# EAGLE design GPIOpiLeafSkell (EAGLE 7.6.0)
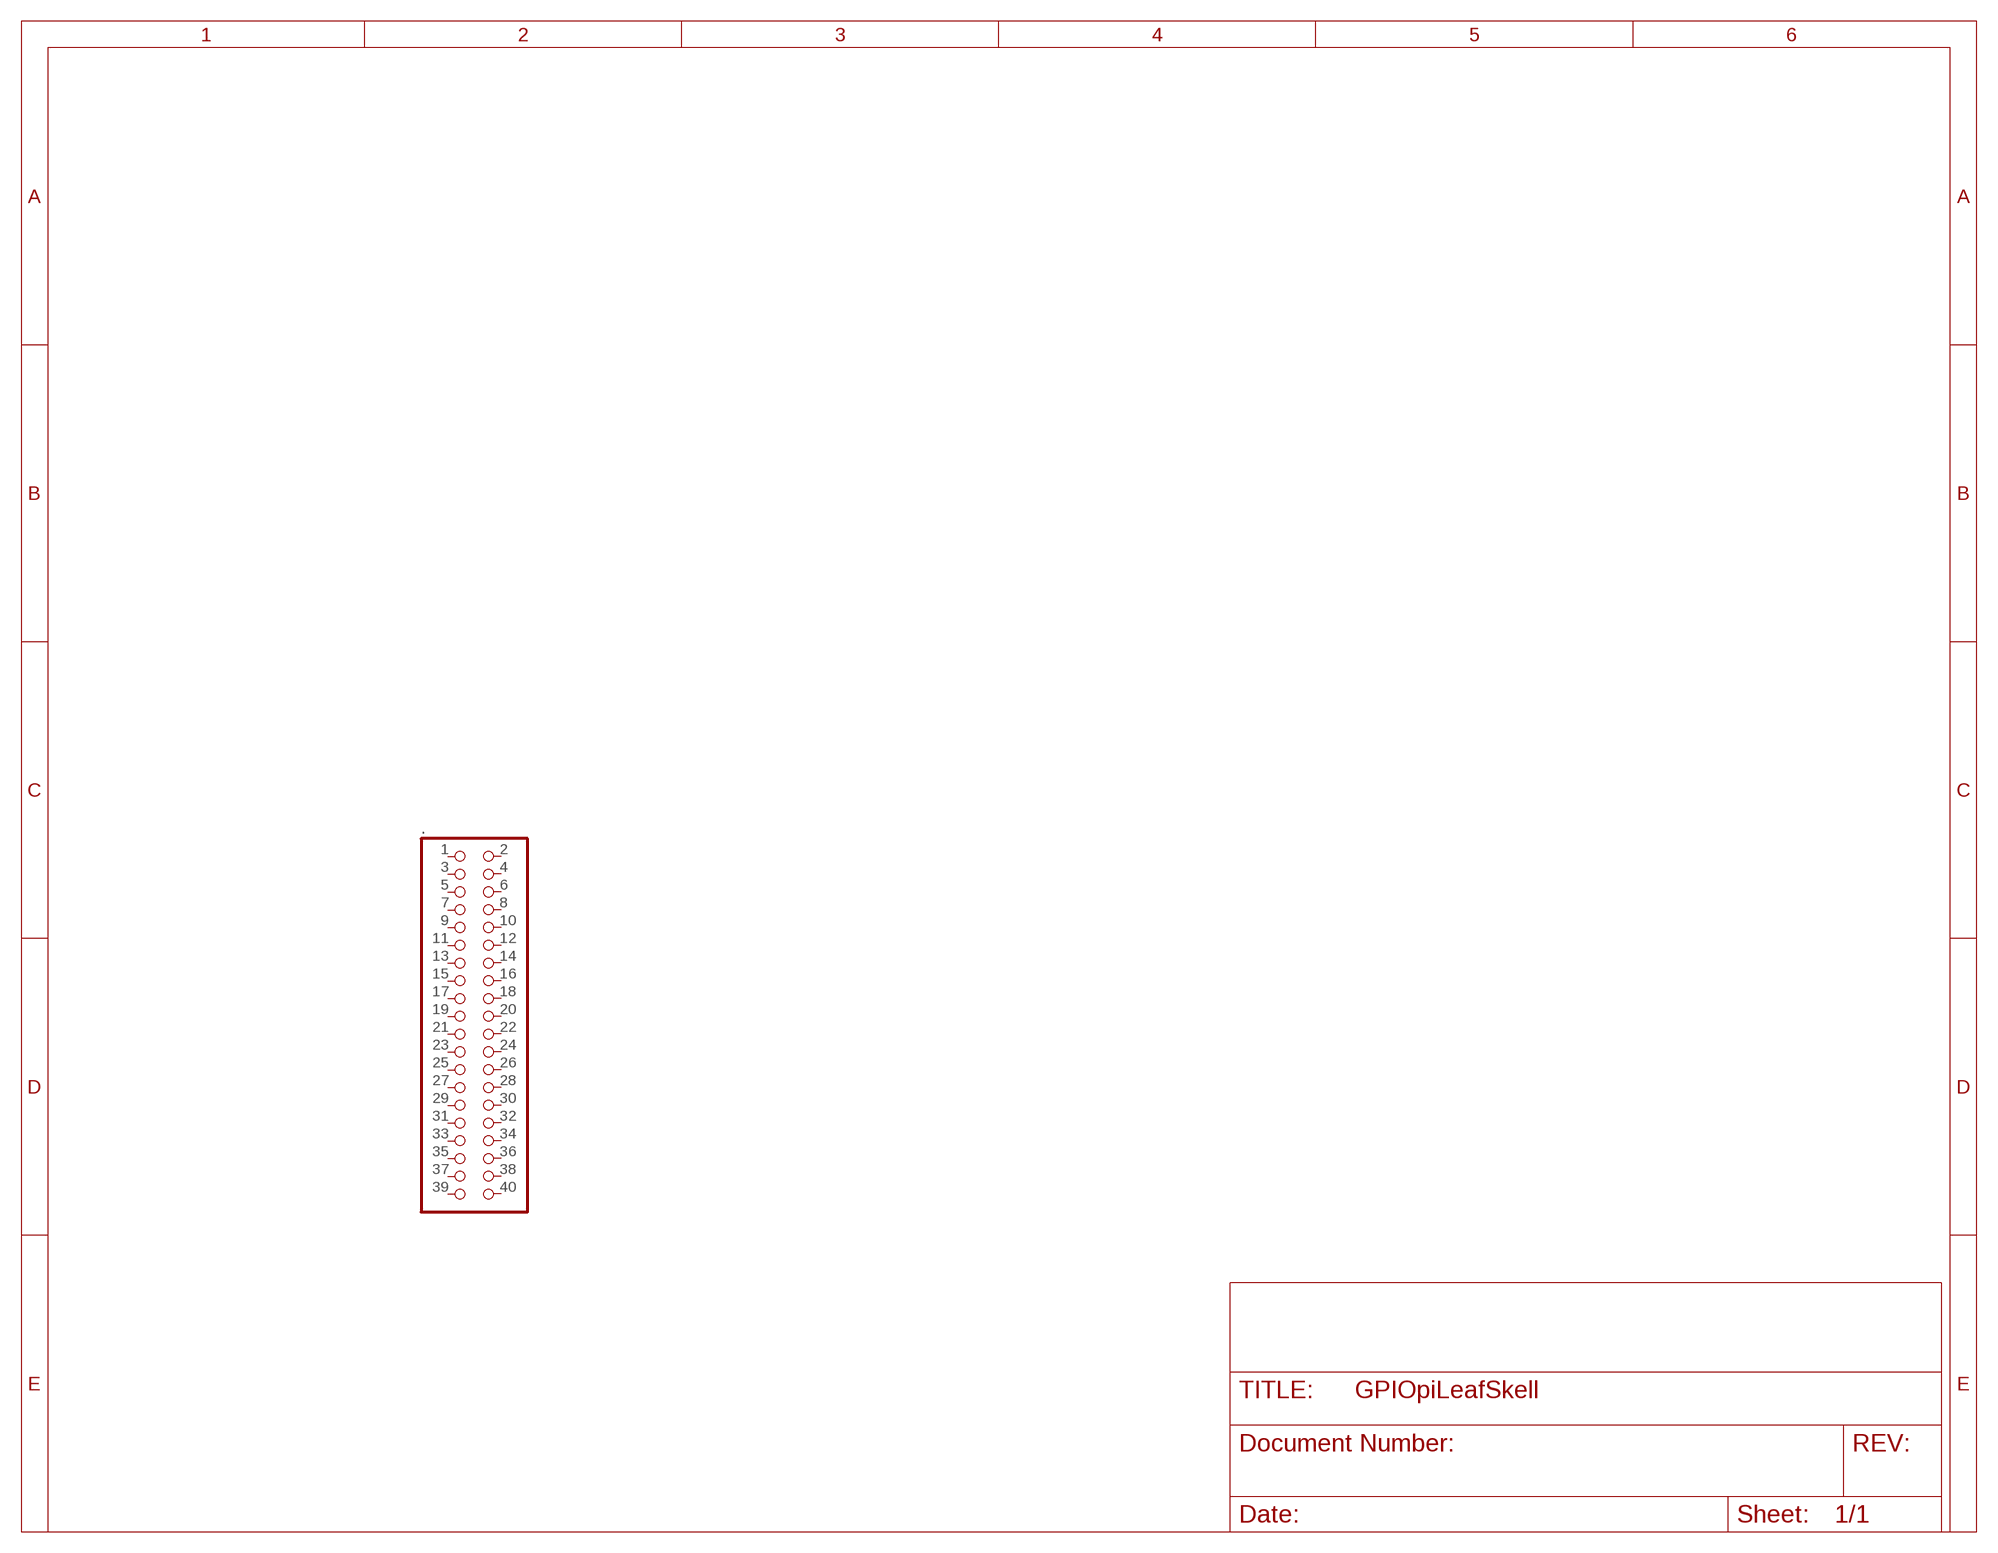
[diagram p0: schematic, sheet 1]

## Parts
.  PINHD-2X20  [2X20]
Unconnected: ..1 ..2 ..3 ..4 ..5 ..6 ..7 ..8 ..9 ..10 ..11 ..12 ..13 ..14 ..15 ..16 ..17 ..18 ..19 ..20 ..21 ..22 ..23 ..24 ..25 ..26 ..27 ..28 ..29 ..30 ..31 ..32 ..33 ..34 ..35 ..36 ..37 ..38 ..39 ..40

## Library data of the parts
. = adafruit:PINHD-2X20: PIN HEADER

## Board
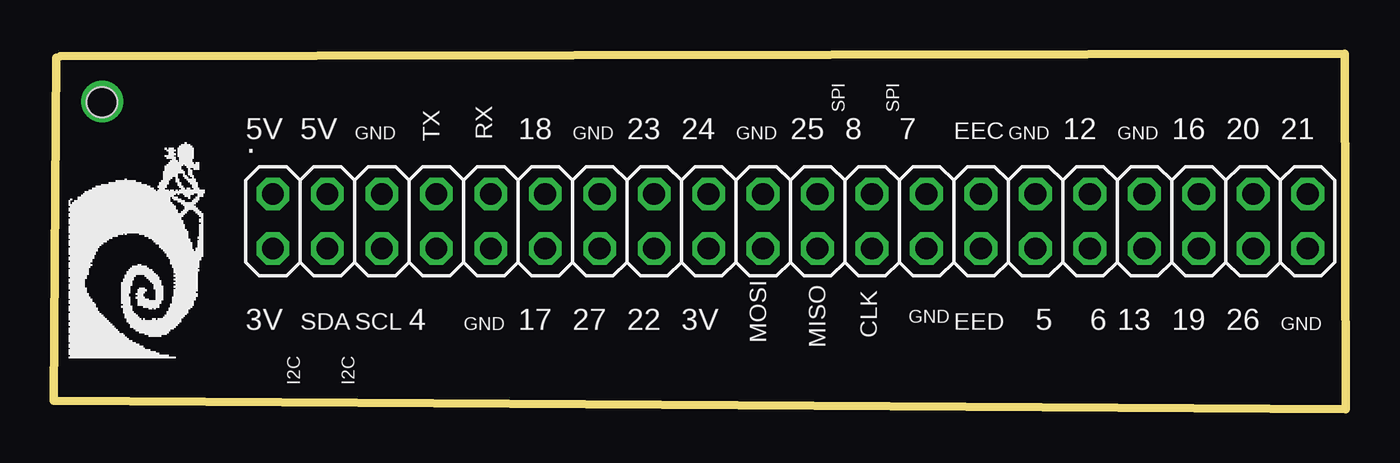
[diagram p1: board, top side]

Size 60.26 x 16.57 mm. Coordinates in mm from the lower left corner, seen from the top.
Outline: 0.13,16.38 0,0.38 60.26,0 60.2,16.57 0.32,16.45
Copper layers (1*16): Top 0.035mm / dielectric 1.5mm / Bottom 0.035mm
Design rules "default": minimum track width 10mil, minimum drill 24mil, track to track 8mil, track to pad 8mil, pad to pad 8mil, via to via 8mil, smd to smd 8mil, copper to edge 40mil, drill to drill 8mil, minimum pad ring 10mil, minimum via ring 8mil, stop-mask expansion 4mil, vias tented up to drill 0mil, thermal gap 10mil
Holes 1.4 mm at 2.26,14.3

### Footprints (pad centres in the part's own frame; a part is rotated, then mirrored left to right if it is on the bottom)
2X20 = drill 1.016 octagon: 1 -24.13,-1.27; 2 -24.13,1.27; 3 -21.59,-1.27; 4 -21.59,1.27; 5 -19.05,-1.27; 6 -19.05,1.27; 7 -16.51,-1.27; 8 -16.51,1.27; 9 -13.97,-1.27; 10 -13.97,1.27; 11 -11.43,-1.27; 12 -11.43,1.27; 13 -8.89,-1.27; 14 -8.89,1.27; 15 -6.35,-1.27; 16 -6.35,1.27; 17 -3.81,-1.27; 18 -3.81,1.27; 19 -1.27,-1.27; 20 -1.27,1.27; 21 1.27,-1.27; 22 1.27,1.27; 23 3.81,-1.27; 24 3.81,1.27; 25 6.35,-1.27; 26 6.35,1.27; 27 8.89,-1.27; 28 8.89,1.27; 29 11.43,-1.27; 30 11.43,1.27; 31 13.97,-1.27; 32 13.97,1.27; 33 16.51,-1.27; 34 16.51,1.27; 35 19.05,-1.27; 36 19.05,1.27; 37 21.59,-1.27; 38 21.59,1.27; 39 24.13,-1.27; 40 24.13,1.27

### Placement (x,y rotation side)
.  34.35,8.76 0 top

### Tracks (layer width: path | path; a pad name or v marks a point on that pad's centre or on a via)
N$1  (via drill 1.3)
  other vias: 2.26,14.34

### Text on the board
tNames: SPI | SPI | 5V | 5V | GND | TX | RX | 18 | GND | 23 | 24 | GND | 25 | 8 | 7 | EEC | GND | 12 | GND | 16 | 20 | 21 | MISO | 3V | SDA | SCL | 4 | GND | 17 | 27 | 22 | 3V | CLK | GND | EED | 5 | 6 | 13 | 19 | 26 | GND | MOSI | I2C | I2C | /Users/nemesiscontreras/Downloads/rsz_1rsz_1rsz_2skellington.bmp